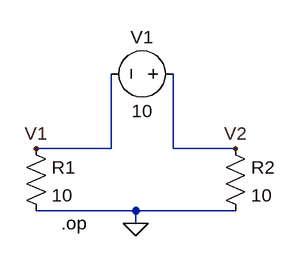
[diagram p0: schematic Draft6.asc]
Draft6.asc, the LTspice schematic file:
Version 4
SHEET 1 880 680
WIRE 160 144 160 48
WIRE 160 144 64 144
WIRE 240 144 240 48
WIRE 320 144 240 144
WIRE 192 224 64 224
WIRE 320 224 192 224
WIRE 192 240 192 224
FLAG 192 240 0
FLAG 320 144 V2
FLAG 64 144 V1
SYMBOL res 48 128 R0
SYMATTR InstName R1
SYMATTR Value 10
SYMBOL res 304 128 R0
SYMATTR InstName R2
SYMATTR Value 10
SYMBOL voltage 256 48 R90
WINDOW 0 -32 56 VBottom 2
WINDOW 3 32 56 VTop 2
SYMATTR InstName V1
SYMATTR Value 10
TEXT 96 240 Left 2 !.op

The netlist it stands for:
* Draft6.asc
R1 V1 0 10
R2 V2 0 10
V1 V2 V1 10
.op
.backanno
.end

* Results of the author's LTspice run, read from the files saved beside the schematic
* Operating Point:
*   V(v1) = -5 V
*   V(v2) = 5 V
*   I(R1) = -500 mA
*   I(R2) = 500 mA
*   I(V1) = -500 mA